# Altium schematic sheet mcu.SchDoc
size A3; SheetNumber: 4; SheetTotal: 4
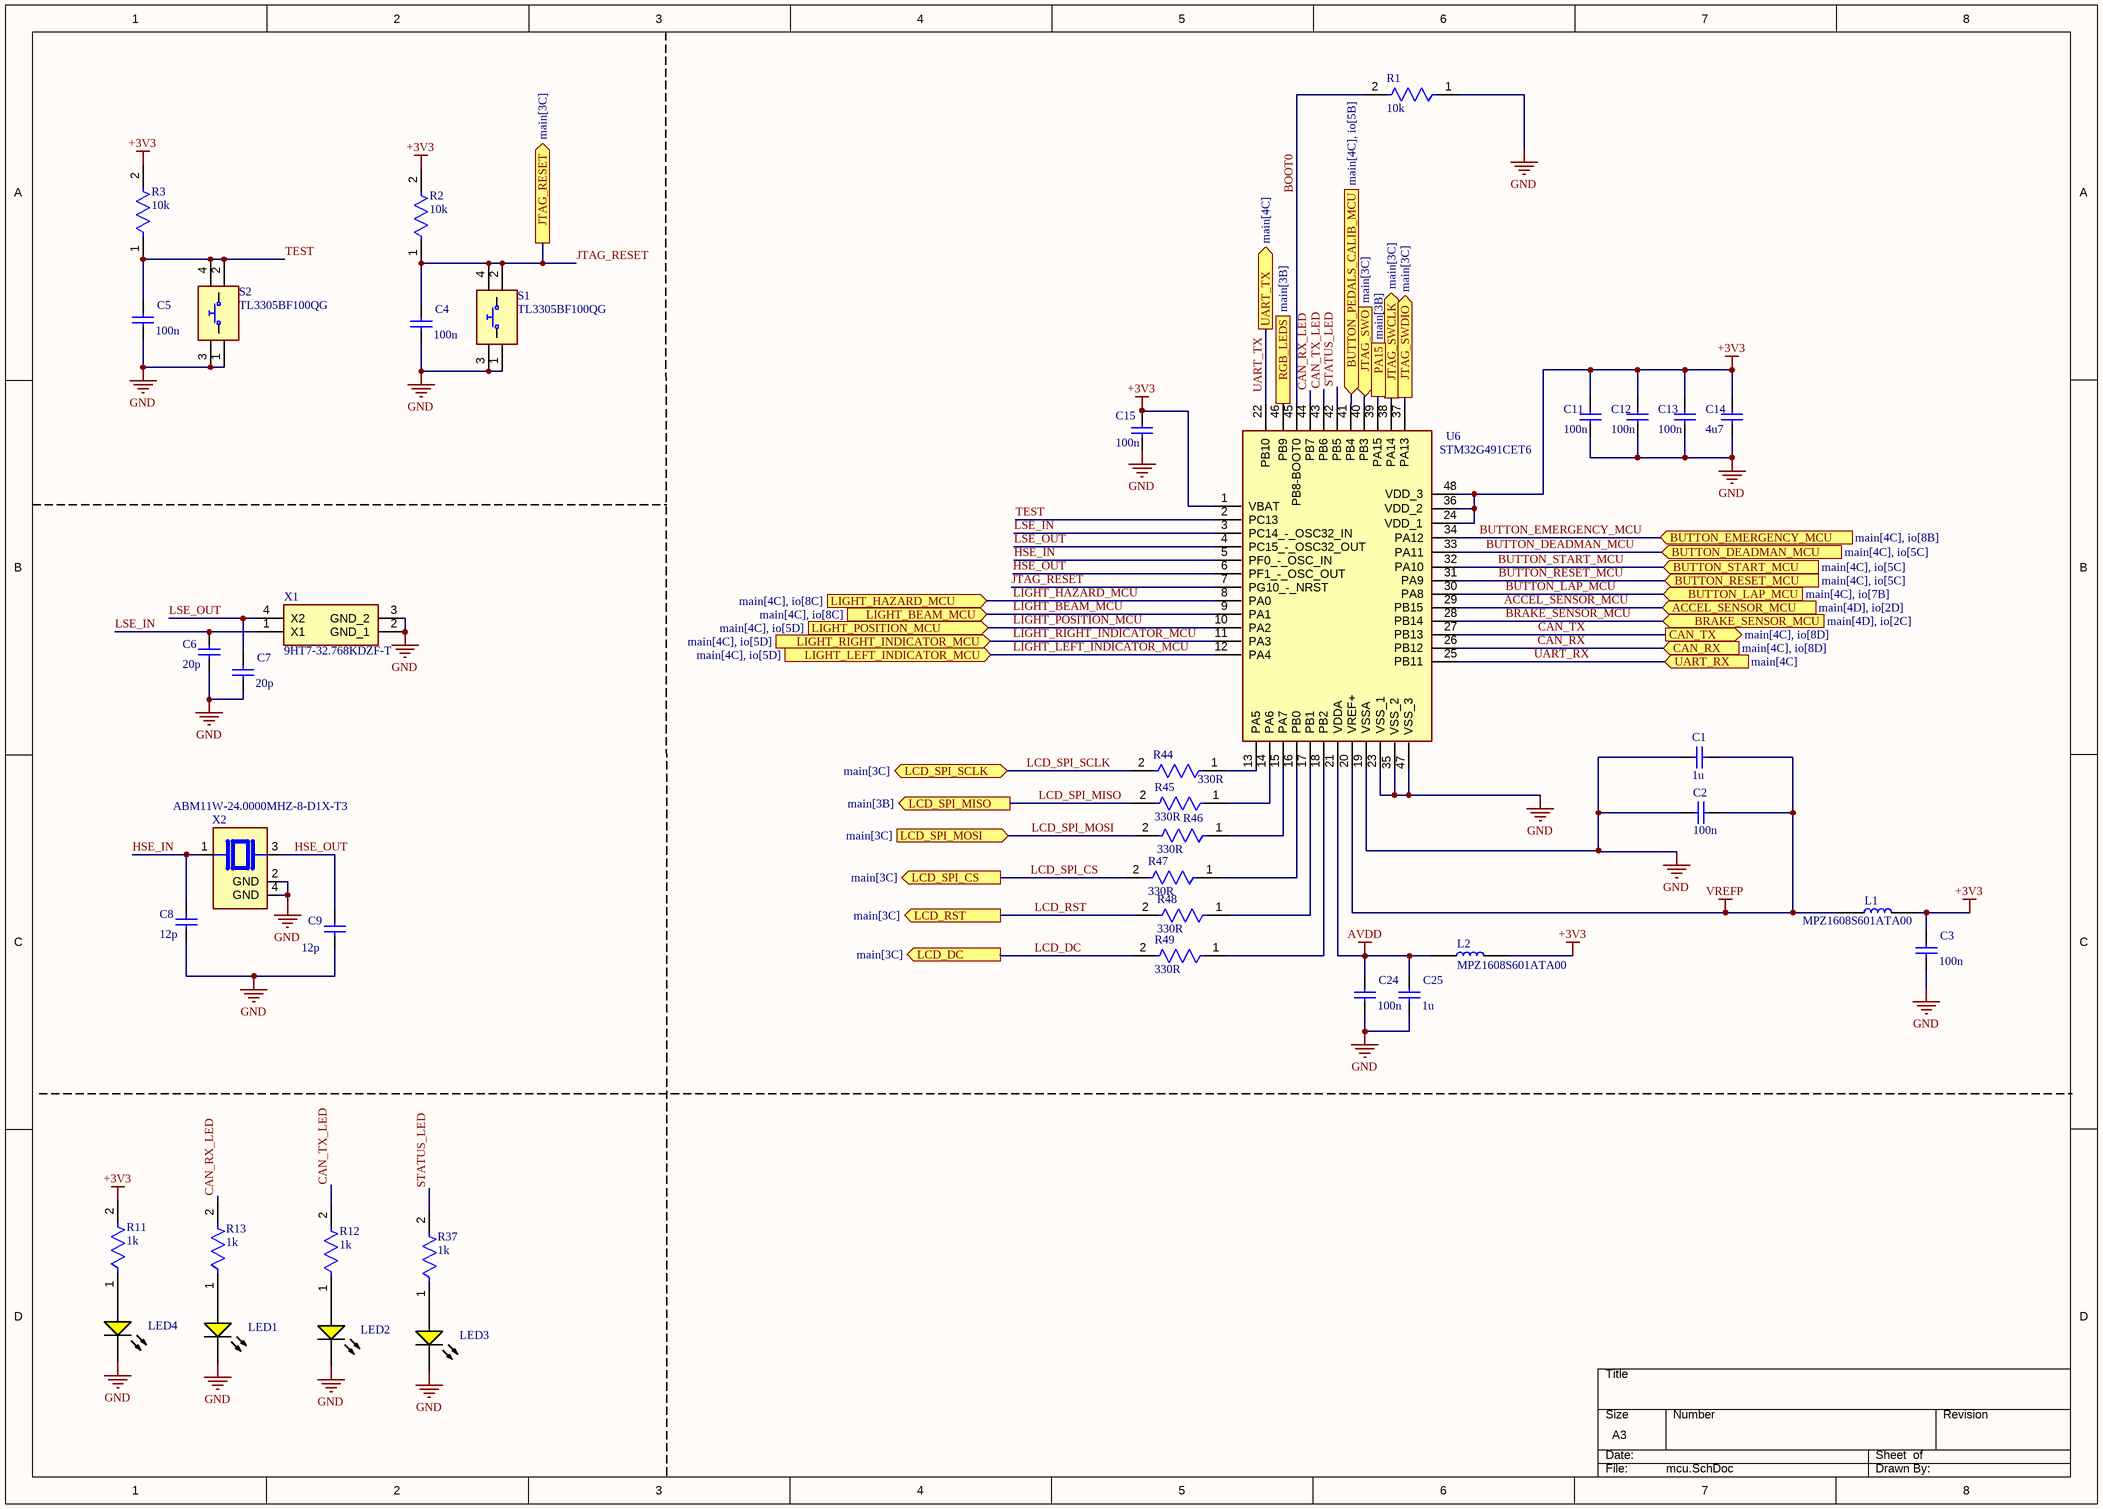
[diagram p0: mcu.SchDoc]

## Parts
C1  1u  [CAPC1206(3216)150_L]
C2  100n  [CAPC1206(3216)150_L]
C3  100n  [CAPC1206(3216)150_L]
C4  100n  [CAPC1206(3216)150_L]
C5  100n  [CAPC1206(3216)150_L]
C6  20p  [CAPC1206(3216)150_L]
C7  20p  [CAPC1206(3216)150_L]
C8  12p  [CAPC1206(3216)150_L]
C9  12p  [CAPC1206(3216)150_L]
C11  100n  [CAPC1206(3216)150_L]
C12  100n  [CAPC1206(3216)150_L]
C13  100n  [CAPC1206(3216)150_L]
C14  4u7  [CAPC1206(3216)150_L]
C15  100n  [CAPC1206(3216)150_L]
C24  100n  [CAPC1206(3216)150_L]
C25  1u  [CAPC1206(3216)150_L]
L1  MPZ1608S601ATA00  [INDC1608X95N]
L2  MPZ1608S601ATA00  [INDC1608X95N]
LED1  (no value)  [LUMX-SML-LX1206YC-TR_V]
LED2  (no value)  [LUMX-SML-LX1206YC-TR_V]
LED3  (no value)  [LUMX-SML-LX1206YC-TR_V]
LED4  (no value)  [LUMX-SML-LX1206YC-TR_V]
R1  10k  [FP-RK73H2B-MFG]
R2  10k  [FP-RK73H2B-MFG]
R3  10k  [FP-RK73H2B-MFG]
R11  1k  [FP-RK73H2B-MFG]
R12  1k  [FP-RK73H2B-MFG]
R13  1k  [FP-RK73H2B-MFG]
R37  1k  [FP-RK73H2B-MFG]
R44  330R  [FP-RK73H2B-MFG]
R45  330R  [FP-RK73H2B-MFG]
R46  330R  [FP-RK73H2B-MFG]
R47  330R  [FP-RK73H2B-MFG]
R48  330R  [FP-RK73H2B-MFG]
R49  330R  [FP-RK73H2B-MFG]
S1  TL3305BF100QG  [TL3305BF160QG]
S2  TL3305BF100QG  [TL3305BF160QG]
U6  STM32G491CET6  [STM32G491CET6]
X1  9HT7-32.768KDZF-T  [9HT732768KDZFT]
X2  ABM11W-24.0000MHZ-8-D1X-T3  [XTAL_ABM11W-24.0000MHZ-8-D1X-T3]

## Ports
ACCEL_SENSOR_MCU (in, see main[4D], io[2D]), BRAKE_SENSOR_MCU (in, see main[4D], io[2C]), BUTTON_DEADMAN_MCU (in, see main[4C], io[5C]), BUTTON_EMERGENCY_MCU (in, see main[4C], io[8B]), BUTTON_LAP_MCU (in, see main[4C], io[7B]), BUTTON_PEDALS_CALIB_MCU (in, see main[4C], io[5B]), BUTTON_RESET_MCU (in, see main[4C], io[5C]), BUTTON_START_MCU (in, see main[4C], io[5C]), CAN_RX (in, see main[4C], io[8D]), CAN_TX (out, see main[4C], io[8D]), JTAG_RESET (out, see main[3C]), JTAG_SWCLK (out, see main[3C]), JTAG_SWDIO (out, see main[3C]), JTAG_SWO (in, see main[3C]), LCD_DC (out, see main[3C]), LCD_RST (out, see main[3C]), LCD_SPI_CS (out, see main[3C]), LCD_SPI_MISO (out, see main[3B]), LCD_SPI_MOSI (in, see main[3C]), LCD_SPI_SCLK (bidir, see main[3C]), LIGHT_BEAM_MCU (in, see main[4C], io[8C]), LIGHT_HAZARD_MCU (in, see main[4C], io[8C]), LIGHT_LEFT_INDICATOR_MCU (in, see main[4C], io[5D]), LIGHT_POSITION_MCU (in, see main[4C], io[5D]), LIGHT_RIGHT_INDICATOR_MCU (in, see main[4C], io[5D]), PA15 (see main[3B]), RGB_LEDS (out, see main[3B]), UART_RX (in, see main[4C]), UART_TX (out, see main[4C])

## Nets
+3V3: C3.1 C11.1 C12.1 C13.1 C14.1 C15.1 L1.2 L2.2 R2.2 R3.2 R11.2 U6.1(VBAT) U6.24(VDD_1) U6.36(VDD_2) U6.48(VDD_3)
AVDD: C24.1 C25.1 L2.1 U6.21(VDDA)
GND: C1.1 C2.1 C3.2 C4.2 C5.2 C6.2 C7.2 C8.2 C9.2 C11.2 C12.2 C13.2 C14.2 C15.2 C24.2 C25.2 LED1.2(K) LED2.2(K) LED3.2(K) LED4.2(K) R1.1 S1.1 S1.3 S2.1 S2.3 U6.19(VSSA) U6.23(VSS_1) U6.35(VSS_2) U6.47(VSS_3) X1.2(GND_1) X1.3(GND_2) X2.2(GND) X2.4(GND)
VREFP: C1.2 C2.2 L1.1 U6.20(VREF+)
ACCEL_SENSOR_MCU: U6.29(PB15) ; port ACCEL_SENSOR_MCU
BOOT0: R1.2 U6.45(PB8-BOOT0)
BRAKE_SENSOR_MCU: U6.28(PB14) ; port BRAKE_SENSOR_MCU
BUTTON_DEADMAN_MCU: U6.33(PA11) ; port BUTTON_DEADMAN_MCU
BUTTON_EMERGENCY_MCU: U6.34(PA12) ; port BUTTON_EMERGENCY_MCU
BUTTON_LAP_MCU: U6.30(PA8) ; port BUTTON_LAP_MCU
BUTTON_PEDALS_CALIB_MCU: U6.41(PB4) ; port BUTTON_PEDALS_CALIB_MCU
BUTTON_RESET_MCU: U6.31(PA9) ; port BUTTON_RESET_MCU
BUTTON_START_MCU: U6.32(PA10) ; port BUTTON_START_MCU
CAN_RX: U6.26(PB12) ; port CAN_RX
CAN_RX_LED: R13.2 U6.44(PB7)
CAN_TX: U6.27(PB13) ; port CAN_TX
CAN_TX_LED: R12.2 U6.43(PB6)
HSE_IN: C8.1 U6.5(PF0_-_OSC_IN) X2.1
HSE_OUT: C9.1 U6.6(PF1_-_OSC_OUT) X2.3
JTAG_RESET: C4.1 R2.1 S1.2 S1.4 U6.7(PG10_-_NRST) ; port JTAG_RESET
JTAG_SWCLK: U6.38(PA14) ; port JTAG_SWCLK
JTAG_SWDIO: U6.37(PA13) ; port JTAG_SWDIO
JTAG_SWO: U6.40(PB3) ; port JTAG_SWO
LCD_DC: R49.2 ; port LCD_DC
LCD_RST: R48.2 ; port LCD_RST
LCD_SPI_CS: R47.2 ; port LCD_SPI_CS
LCD_SPI_MISO: R45.2 ; port LCD_SPI_MISO
LCD_SPI_MOSI: R46.2 ; port LCD_SPI_MOSI
LCD_SPI_SCLK: R44.2 ; port LCD_SPI_SCLK
LIGHT_BEAM_MCU: U6.9(PA1) ; port LIGHT_BEAM_MCU
LIGHT_HAZARD_MCU: U6.8(PA0) ; port LIGHT_HAZARD_MCU
LIGHT_LEFT_INDICATOR_MCU: U6.12(PA4) ; port LIGHT_LEFT_INDICATOR_MCU
LIGHT_POSITION_MCU: U6.10(PA2) ; port LIGHT_POSITION_MCU
LIGHT_RIGHT_INDICATOR_MCU: U6.11(PA3) ; port LIGHT_RIGHT_INDICATOR_MCU
LSE_IN: C6.1 U6.3(PC14_-_OSC32_IN) X1.1(X1)
LSE_OUT: C7.1 U6.4(PC15_-_OSC32_OUT) X1.4(X2)
PA15: U6.39(PA15) ; port PA15
RGB_LEDS: U6.46(PB9) ; port RGB_LEDS
STATUS_LED: R37.2 U6.42(PB5)
TEST: C5.1 R3.1 S2.2 S2.4 U6.2(PC13)
UART_RX: U6.25(PB11) ; port UART_RX
UART_TX: U6.22(PB10) ; port UART_TX
NetLED1_1: LED1.1(A) R13.1
NetLED2_1: LED2.1(A) R12.1
NetLED3_1: LED3.1(A) R37.1
NetLED4_1: LED4.1(A) R11.1
NetR44_1: R44.1 U6.13(PA5)
NetR45_1: R45.1 U6.14(PA6)
NetR46_1: R46.1 U6.15(PA7)
NetR47_1: R47.1 U6.16(PB0)
NetR48_1: R48.1 U6.17(PB1)
NetR49_1: R49.1 U6.18(PB2)

## Notes on the sheet
- DWG. NO.
- REV.
- SHT.
- REVISION
- DESCRIPTION
- DATE
- APPROVED
- THIS DOCUMENT AND THE DATA DISCLOSED HEREIN OR HEREWITH IS THE PROPERTY OF ALTIUM LIMITED AND MAY BE FREELY DISTRIBUTED IN WHOLE. NO RIGHTS ARE RESERVED OR EXPRESS OR IMPLIED WARANTEE GIVEN.
- ENG:
- DSN:
- APPROVALS
- PROJECT
- DOCUMENT REVISION:
- DESIGN ITEM:
- CHK:
- BOM:
- REFERENCE DOCUMENTS
- PROJECT REVISION:
- TITLE
- FAB DWG:
- PCB DWG:
- ASSY DWG:
- SCALE:
- SIZE
- C
- CAGE CODE
- FILE NAME
- DWG NO.
- SHEET
- OF
- REV

## Library data of the parts
C1-C9 C11-C15 C24 C25 = CMP-1037-04778-1: CAP 1.8uF 10V ±5% 1206 (3216 Metric) Thickness 1.45mm SMD; Case-EIA: 1206; Tolerance: Â±5%; Case-Metric: 3216; Technology: SMT; Value: 1.8uF; Rated Voltage: 10 V; Max Thickness: 1.45 mm
L1 L2 = MPZ1608S601ATA00: Ferrite Beads Multi-Layer 600Ohm 25% 100MHz 1A 0.15Ohm DCR 0603 T/R; Manufacturer Lifecycle Status: PRODUCTION; MF: TDK; DC Resistance (DCR): 150mΩ; Impedance: 600Ω; Number of Circuits: 1; SnapEDA_Link: https://www.snapeda.com/parts/MPZ1608S601ATA00/TDK/view-part/?ref=snap; Package: 0603 TDK; Value: *; MP: MPZ1608S601ATA00; Check_prices: https://www.snapeda.com/parts/MPZ1608S601ATA00/TDK/view-part/?ref=eda; Supplier: Farnell; Supplier Part Number: 2800777; Manufacturer: TDK; Manufacturer Part Number: MPZ1608S601ATA00; RoHS: Compliant; Category: Ferrite Beads and Chips; Stock: 80000; Case/Package: 0603; Case Code (Imperial): 0603; Case Code (Metric): 1608; China RoHS: Compliant; Core Material: Ferrite; Current Rating: 1A; Depth: 800µm; Height: 800µm; Lead Free: Lead Free; Length: 1.6mm; Lifecycle Status: Production; Max DC Current: 1A; Clock Frequency: 100MHz; Max Length: 1.75mm; Max Operating Temperature: 125°C; Max Width: 950µm; Min Length: 1.45mm; Min Operating Temperature: -55°C; Min Width: 650µm; Mounting Technology: Surface Mount; Number of Terminals: 2; Packaging: Cut Tape; REACH SVHC: Yes; RMS Current (Irms): 1A; Schedule B: 8504500000, 8504500000|8504500000|8504500000|8504500000|8504500000; ESR: 150mΩ; Termination: SMD/SMT; Test Frequency: 100MHz; Tolerance: 25%; Weight: 2.012816mg; Width: 800µm; ComponentLink1URL: https://datasheet.octopart.com:443/MPZ1608S601ATA00-TDK-datasheet-155380319.pdf?src-supplier=TDK; ComponentLink1Description: https://datasheet.octopart.com:443/MPZ1608S601ATA00-TDK-datasheet-155380319.pdf?src-supplier=TDK; ComponentLink2URL: https://datasheet.octopart.com:443/MPZ1608S601ATA00-TDK-datasheet-141913842.pdf?src-supplier=TME; ComponentLink2Description: https://datasheet.octopart.com:443/MPZ1608S601ATA00-TDK-datasheet-141913842.pdf?src-supplier=TME; ComponentLink3URL: https://datasheet.octopart.com:443/MPZ1608S601ATA00-TDK-datasheet-82475260.pdf?src-supplier=Newark; ComponentLink3Description: https://datasheet.octopart.com:443/MPZ1608S601ATA00-TDK-datasheet-82475260.pdf?src-supplier=Newark; ComponentLink4URL: https://datasheet.octopart.com:443/MPZ1608S601ATA00-TDK-datasheet-99917310.pdf?src-supplier=Newark; ComponentLink4Description: https://datasheet.octopart.com:443/MPZ1608S601ATA00-TDK-datasheet-99917310.pdf?src-supplier=Newark; ComponentLink5URL: https://datasheet.octopart.com:443/MPZ1608S601ATA00-TDK-datasheet-8852356.pdf?src-supplier=Newark; ComponentLink5Description: https://datasheet.octopart.com:443/MPZ1608S601ATA00-TDK-datasheet-8852356.pdf?src-supplier=Newark; ComponentLink6URL: https://datasheet.octopart.com:443/MPZ1608S601ATA00-TDK-datasheet-21631858.pdf?src-supplier=Farnell; ComponentLink6Description: https://datasheet.octopart.com:443/MPZ1608S601ATA00-TDK-datasheet-21631858.pdf?src-supplier=Farnell; ComponentLink7URL: https://datasheet.octopart.com:443/MPZ1608S601ATA00-TDK-datasheet-38423207.pdf?src-supplier=Future+Electronics; ComponentLink7Description: https://datasheet.octopart.com:443/MPZ1608S601ATA00-TDK-datasheet-38423207.pdf?src-supplier=Future+Electronics
LED1-LED4 = CMP-2000-07124-1: Yellow LED, Water Clear Len, 585 nm, 2.1 V, -40 to 85 degC, 2-Pin SMD, RoHS, Tape and Reel; Manufacturer: Lumex; Product Training Modules: LEDsBenefitsofCustomLEDandLCDTechnology; Millicandela Rating: 6mcd; Catalog Drawings: SML-LX1206SeriesTopSML-LX1206SeriesSideSML-LX1206SeriesBottomSML-LX1206SeriesFootprint; Wavelength - Peak: 585nm; Other Names: 67-1358-2LU60357TRSMLLX1206YCTR; Lens Style/Size: RectanglewithFlatTop; Current - Test: 20mA; Lens Color: Colorless; Viewing Angle: 160°; Voltage - Forward (Vf) (Typ): 2.1V; Online Catalog: SML-LX1206RectanglewithFlatTop1206PackageLEDs; Mounting Type: SurfaceMount; Package Description: 2-Pin Surface Mount Device, Body 3.2 x 1.5 mm; Datasheet Version: Rev. K, 08/2012; Features: -; Color: Yellow; RoHS Information: RoHSCertofCompliance; Package Reference: SML-LX1206YC-TR; Supplier Device Package: 1206; Standard Package: 3,000; Series: -; Wavelength - Dominant: -; Package / Case: 1206(3216Metric); Mounting Technology: SurfaceMount; Height (Max): 1.10mm; Lens Transparency: Clear; Datasheet URL: http://www.lumex.com/content/files/ProductAttachment/SML-LX1206YC-TR.pdf; Family: LEDIndication-Discrete; Manufacturer URL: http://www.lumexinstruments.com/; Packaging: Tape&Reel(TR); Category: Optoelectronics; Size / Dimension: 3.20mmLx1.60mmW
R1-R3 R11-R13 R37 R44-R49 = CMP-04015-098385-1: 40.2kΩ ±1% 0.25W Chip Resistor 1206 Thick Film AEC-Q200 Qualified; Resistance: 40.2kR; Voltage Rating (DC): 200V; Temperature Coefficient: 100ppm/°C; Power Rating: 250mW; Tolerance: 1%; Package Quantity: 5000; Length: 3.2mm; Termination: SMD/SMT; Lead Free: Contains Lead; Case Code (Imperial): 1206; Case/Package: 1206; Voltage Rating: 200V; Case Code (Metric): 3216; Max Operating Temperature: 155°C; Packaging: Tape and Reel; Width: 1.6mm; Series: RK73H; Min Operating Temperature: -55°C; RoHS Compliant: No; Height: 0.6mm
S1 S2 = TL3305BF100QG: TL3305 Ultra-Miniature Tact Switch 100gf 5.0mm actuator Silver Contact Gullwing; Manufacturer_Name: E-Switch; Datasheet Link: https://configured-product-images.s3.amazonaws.com/2D/specs/TL3305BF100QG.pdf; Manufacturer_Part_Number: TL3305BF100QG; Mouser Part Number: 612-TL3305BF100QG; Mouser Price/Stock: https://www.mouser.co.uk/ProductDetail/E-Switch/TL3305BF100QG?qs=IKkN%2F947nfDIPwqPQja%252BvQ%3D%3D; Supplier: Farnell; Supplier Part Number: 4539028; Manufacturer: E-Switch; Manufacturer Part Number: TL3305BF100QG; RoHS: Compliant; Category: Tactile Switches; Stock: 11760; ComponentLink1URL: https://datasheet.octopart.com:443/TL3305BF100QG-E-Switch-datasheet-181388209.pdf?src-supplier=Future+Electronics; ComponentLink1Description: https://datasheet.octopart.com:443/TL3305BF100QG-E-Switch-datasheet-181388209.pdf?src-supplier=Future+Electronics; ComponentLink2URL: https://datasheet.octopart.com:443/TL3305BF100QG-E-Switch-datasheet-188129426.pdf?src-supplier=Future+Electronics; ComponentLink2Description: https://datasheet.octopart.com:443/TL3305BF100QG-E-Switch-datasheet-188129426.pdf?src-supplier=Future+Electronics
U6 = STM32G491CET6: ARM Microcontrollers - MCU Mainstream Arm Cortex-M4+ MCU 170MHz with 512Kbytes of Flash memory; Manufacturer_Name: STMicroelectronics; Geometry.Height: 1.6mm; Manufacturer_Part_Number: STM32G491CET6; Mouser Part Number: 511-STM32G491CET6; Mouser Price/Stock: https://www.mouser.co.uk/ProductDetail/STMicroelectronics/STM32G491CET6?qs=eP2BKZSCXI5LxAF%2FNuF5Tg%3D%3D; Arrow Part Number: STM32G491CET6; Arrow Price/Stock: https://www.arrow.com/en/products/stm32g491cet6/stmicroelectronics?region=nac; Datasheet Link: https://cz.mouser.com/datasheet/2/389/dm00654712-2042072.pdf; Supplier: Mouser; Supplier Part Number: 511-STM32G491CET6; Supplier 1: Mouser; Supplier Part Number 1: 511-STM32G491CET6; ComponentLink1Description: Datasheet; ComponentLink1URL: https://datasheet.octopart.com/STM32G491CET6-STMicroelectronics-datasheet-151949616.pdf?src-supplier=Future+Electronics
X1 = 9HT7-32.768KDZF-T: Parallel - Fundamental Quartz Crystal, 0.032768MHz Nom; Manufacturer_Name: TXC CORPORATION; Manufacturer: TXC; Geometry.Height: 1.4mm; ESR (Equivalent Series Resistance): 65kΩ; Frequency: 32.768kHz; Frequency Tolerance: 0.002%; Load Capacitance: 12.5pF; Manufacturer_Part_Number: 9HT7-32.768KDZF-T; Mouser Part Number: 717-9HT7-32.768KDZFT; Mouser Price/Stock: https://www.mouser.co.uk/ProductDetail/TXC-Corporation/9HT7-32.768KDZF-T?qs=MEJ8UTjcHDlobjP3Uu4Bsg%3D%3D; Arrow Part Number: 9HT7-32.768KDZF-T; Arrow Price/Stock: https://www.arrow.com/en/products/9ht7-32.768kdzf-t/txc-corporation?region=nac; Datasheet Link: https://componentsearchengine.com/Datasheets/2/9HT7-32.768KDZF-T.pdf; Supplier: Farnell; Supplier Part Number: 2819319; Manufacturer Part Number: 9HT7-32.768KDZF-T; RoHS: Compliant; Category: Crystals; Stock: 7957; Case/Package: SMD/SMT; Height: 508µm; Lead Free: Lead Free; Length: 1.4mm; Lifecycle Status: Production; Max Operating Temperature: 85°C; Min Operating Temperature: -40°C; Mounting Technology: Surface Mount; Packaging: Tape & Reel; REACH SVHC: No; Schedule B: 8541600080, 8541600080|8541600080|8541600080|8541600080|8541600080|8541600080|8541600080|8541600080|8541600080|8541600080|8541600080|8541600080|8541600080|8541600080|8541600080|8541600080|8541600080|8541600080|8541600080|8541600080|8541600080|8541600080|8541600080|85; Termination: SMD/SMT; Tolerance: 0.002%; Width: 1.397mm; ComponentLink1URL: https://datasheet.octopart.com:443/9HT7-32.768KDZF-T-TXC-datasheet-21225340.pdf?src-supplier=element14+APAC; ComponentLink1Description: https://datasheet.octopart.com:443/9HT7-32.768KDZF-T-TXC-datasheet-21225340.pdf?src-supplier=element14+APAC; ComponentLink2URL: https://datasheet.octopart.com:443/9HT7-32.768KDZF-T-TXC-datasheet-181441158.pdf?src-supplier=Newark; ComponentLink2Description: https://datasheet.octopart.com:443/9HT7-32.768KDZF-T-TXC-datasheet-181441158.pdf?src-supplier=Newark; ComponentLink3URL: https://datasheet.octopart.com:443/9HT7-32.768KDZF-T-TXC-datasheet-188932442.pdf?src-supplier=TME; ComponentLink3Description: https://datasheet.octopart.com:443/9HT7-32.768KDZF-T-TXC-datasheet-188932442.pdf?src-supplier=TME
X2 = ABM11W-24.0000MHZ-8-D1X-T3: Crystal, Quartz, 24 MHz, SMD, 2mm x 1.6mm x 0.5mm, 20 ppm, 8 pF, 10 ppm, ABM11W; Manufacturer: Abracon; MF: Abracon LLC; ESR (Equivalent Series Resistance): 100Ω; Frequency: 24MHz; Frequency Stability: 20ppm; Frequency Tolerance: 0.001%; Load Capacitance: 8pF; ESR: 30Ω; SnapEDA_Link: https://www.snapeda.com/parts/ABM11W-24.0000MHZ-8-D1X-T3/Abracon/view-part/?ref=snap; Package: SMD-4 Abracon LLC; Value: *; MP: ABM11W-24.0000MHZ-8-D1X-T3; Check_prices: https://www.snapeda.com/parts/ABM11W-24.0000MHZ-8-D1X-T3/Abracon/view-part/?ref=eda; Supplier: DigiKey; Supplier Part Number: 535-13835-1-ND; Manufacturer Part Number: ABM11W-24.0000MHZ-8-D1X-T3; RoHS: Compliant; Category: Crystals; Stock: 2752; Pricing: 1=0,38, 10=0,334, 25=0,3156, 50=0,3024, 100=0,29, 250=0,27424, 500=0,26288, 1000=0,25201 (USD); China RoHS: Compliant; Height: 500µm; Length: 2mm; Lifecycle Status: Production; Max Operating Temperature: 85°C; Min Operating Temperature: -40°C; Mounting Technology: Surface Mount; REACH SVHC: Yes; Tolerance: 0.001%; Width: 1.6mm; ComponentLink1URL: https://datasheet.octopart.com:443/ABM11W-24.0000MHZ-8-D1X-T3-Abracon-datasheet-154833168.pdf?src-supplier=IHS; ComponentLink1Description: https://datasheet.octopart.com:443/ABM11W-24.0000MHZ-8-D1X-T3-Abracon-datasheet-154833168.pdf?src-supplier=IHS; ComponentLink2URL: https://datasheet.octopart.com:443/ABM11W-24.0000MHZ-8-D1X-T3-Abracon-datasheet-102760955.pdf?src-supplier=Upverter; ComponentLink2Description: https://datasheet.octopart.com:443/ABM11W-24.0000MHZ-8-D1X-T3-Abracon-datasheet-102760955.pdf?src-supplier=Upverter; ComponentLink3URL: https://datasheet.octopart.com:443/ABM11W-24.0000MHZ-8-D1X-T3-Abracon-datasheet-112015802.pdf?src-supplier=Master+Electronics; ComponentLink3Description: https://datasheet.octopart.com:443/ABM11W-24.0000MHZ-8-D1X-T3-Abracon-datasheet-112015802.pdf?src-supplier=Master+Electronics; ComponentLink4URL: https://datasheet.octopart.com:443/ABM11W-24.0000MHZ-8-D1X-T3-Abracon-datasheet-182204996.pdf?src-supplier=Master+Electronics; ComponentLink4Description: https://datasheet.octopart.com:443/ABM11W-24.0000MHZ-8-D1X-T3-Abracon-datasheet-182204996.pdf?src-supplier=Master+Electronics; ComponentLink5URL: https://sigma.octopart.com:443/141159858/technical_drawing/Abracon-ABM11W-24.0000MHZ-8-D1X-T3.pdf?src-supplier=Abracon+SCT; ComponentLink5Description: https://sigma.octopart.com:443/141159858/technical_drawing/Abracon-ABM11W-24.0000MHZ-8-D1X-T3.pdf?src-supplier=Abracon+SCT; ComponentLink6URL: http://sigma.octopart.com:80/conflict_mineral_statement/Abracon-company-27.pdf?src-supplier=Compliance+Statements; ComponentLink6Description: http://sigma.octopart.com:80/conflict_mineral_statement/Abracon-company-27.pdf?src-supplier=Compliance+Statements